# EAGLE design MotorBoard (EAGLE 7.4.0)
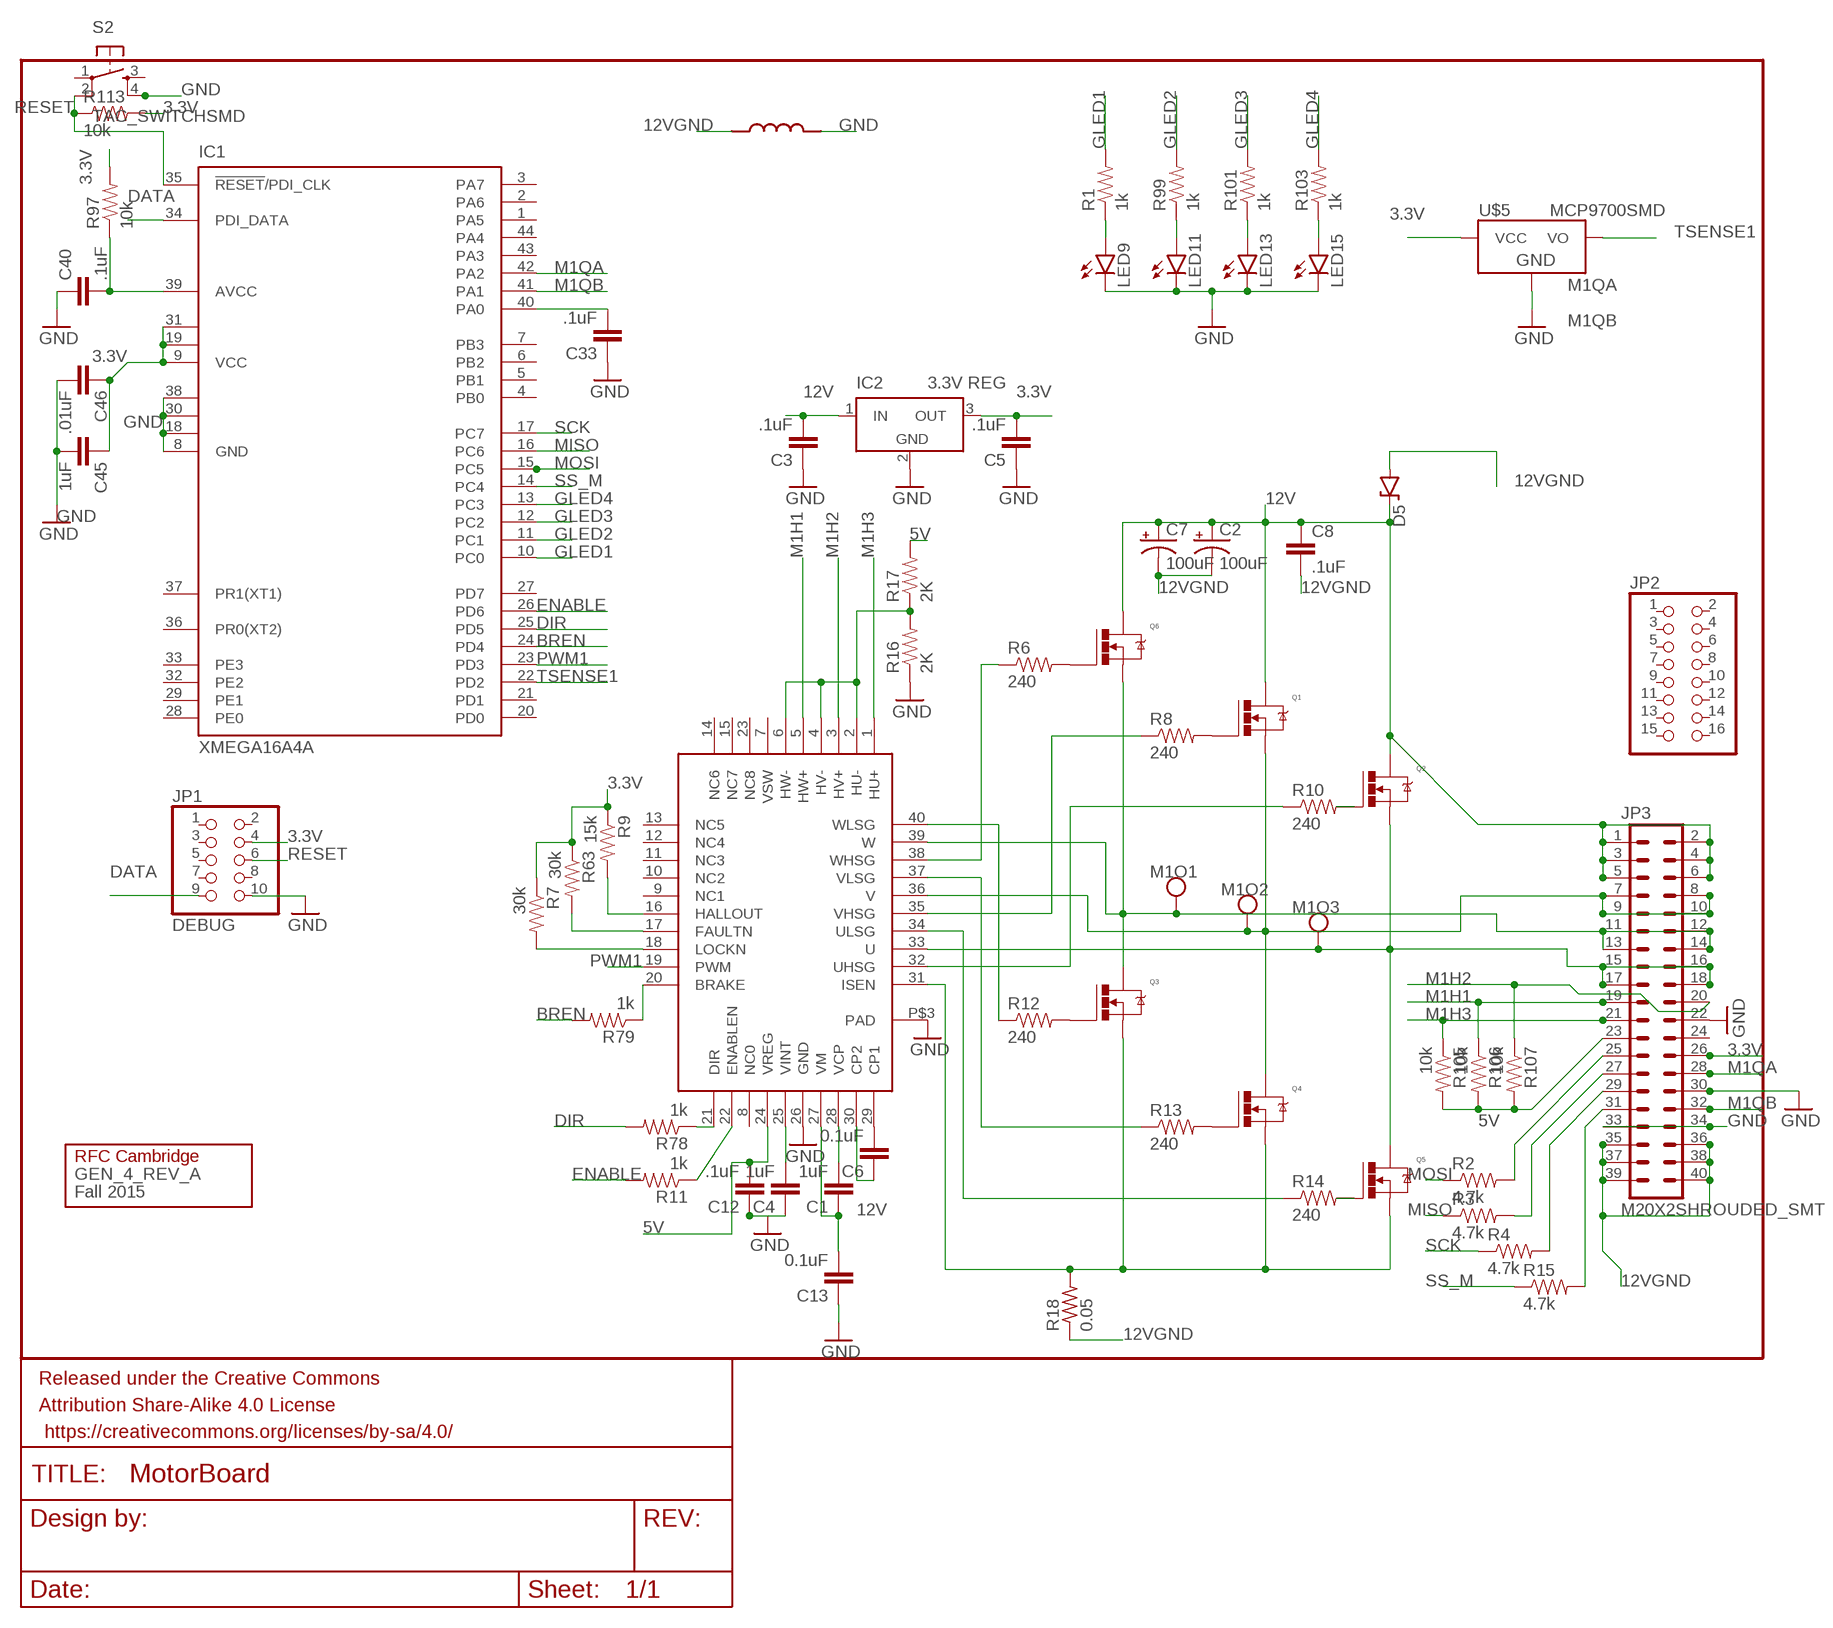
[diagram p0: schematic, sheet 1]

## Parts
C1  1uF  CAP0805  [0805]
C2  100uF  CAP-POLAR  [PANASONIC_D]
C3  .1uF  CAP0805  [0805]
C4  1uF  CAP0805  [0805]
C5  .1uF  CAP0805  [0805]
C6  0.1uF  CAP0805  [0805]
C7  100uF  CAP-POLAR  [PANASONIC_D]
C8  .1uF  CAP0805  [0805]
C12  .1uF  CAP0805  [0805]
C13  0.1uF  CAP0805  [0805]
C33  .1uF  CAP0805  [0805]
C40  .1uF  CAP0805  [0805]
C45  1uF  CAP0805  [0805]
C46  .01uF  CAP0805  [0805]
D5  DIODE-ZENERDO214AC  [DO214AC]
FRAME7  FRAME-LETTER  [CREATIVE_COMMONS]
GEN_4_REV_A  Fall 2015  LOGO  [LOGO]
IC1  XMEGA16A4A  [TQFP44]
IC2  3.3V REG  LT1129CST5  [SOT223]
JP1  DEBUG  PINHD-2X5  [2X05]
JP2  PINHD-2X8  [2X08]
JP3  M20X2SHROUDED_SMT  [2X20_SHROUDED_SMT]
LED9  LED1206  [LED-1206]
LED11  LED1206  [LED-1206]
LED13  LED1206  [LED-1206]
LED15  LED1206  [LED-1206]
M1O1  TEST_PT  [TESTING_PT]
M1O2  TEST_PT  [TESTING_PT]
M1O3  TEST_PT  [TESTING_PT]
Q1  N-MOSFET  [DPAK]
Q2  N-MOSFET  [DPAK]
Q3  N-MOSFET  [DPAK]
Q4  N-MOSFET  [DPAK]
Q5  N-MOSFET  [DPAK]
Q6  N-MOSFET  [DPAK]
R1  1k  RESISTOR0805-RES  [0805]
R2  4.7k  RESISTOR0805-RES  [0805]
R3  4.7k  RESISTOR0805-RES  [0805]
R4  4.7k  RESISTOR0805-RES  [0805]
R6  240  RESISTOR0805-RES  [0805]
R7  30k  RESISTOR0805-RES  [0805]
R8  240  RESISTOR0805-RES  [0805]
R9  15k  RESISTOR0805-RES  [0805]
R10  240  RESISTOR0805-RES  [0805]
R11  1k  RESISTOR0805-RES  [0805]
R12  240  RESISTOR0805-RES  [0805]
R13  240  RESISTOR0805-RES  [0805]
R14  240  RESISTOR0805-RES  [0805]
R15  4.7k  RESISTOR0805-RES  [0805]
R16  2K  RESISTOR0805-RES  [0805]
R17  2K  RESISTOR0805-RES  [0805]
R18  0.05  R-US_R2512  [R2512]
R63  30k  RESISTOR0805-RES  [0805]
R78  1k  RESISTOR0805-RES  [0805]
R79  1k  RESISTOR0805-RES  [0805]
R97  10k  RESISTOR0805-RES  [0805]
R99  1k  RESISTOR0805-RES  [0805]
R101  1k  RESISTOR0805-RES  [0805]
R103  1k  RESISTOR0805-RES  [0805]
R105  10k  RESISTOR0805-RES  [0805]
R106  10k  RESISTOR0805-RES  [0805]
R107  10k  RESISTOR0805-RES  [0805]
R113  10k  RESISTOR0805-RES  [0805]
S2  TAC_SWITCHSMD  [TACTILE-SWITCH-SMD]
U$1  DRV8307  [QFN40-6X6]
U$2  INDUCTOR  [0805]
U$5  MCP9700SMD  [SOT23-3]

## Nets
3.3V: C5.2 C45.1 C46.1 IC1.9(VCC) IC1.19(VCC1) IC1.31(VCC2) IC2.3(OUT) JP1.4 JP3.26 R7.1 R9.1 R63.1 R97.2 R113.2 U$5.1(VCC)
5V: C12.2 JP3.23 R17.2 R105.2 R106.2 R107.2 U$1.24(VREG)
12V: C1.1 C2.+ C3.2 C7.+ C8.1 C13.2 D5.C IC2.1(IN) JP3.1 JP3.2 JP3.3 JP3.4 JP3.5 JP3.6 Q1.DRAIN Q2.DRAIN Q6.DRAIN U$1.27(VM)
12VGND: C2.- C7.- C8.2 D5.A JP3.35 JP3.36 JP3.37 JP3.38 JP3.39 JP3.40 R18.1 U$2.1
AVCC: C40.2 IC1.39(AVCC) R97.1
BREN: IC1.24(PD4) R79.2
DATA: IC1.34(PDI_DATA) JP1.9
DIR: IC1.25(PD5) R78.2
ENABLE: IC1.26(PD6) R11.2
GLED1: IC1.10(PC0) R1.2
GLED2: IC1.11(PC1) R99.2
GLED3: IC1.12(PC2) R101.2
GLED4: IC1.13(PC3) R103.2
GND: C3.1 C4.1 C5.1 C12.1 C13.1 C33.1 C40.1 C45.2 C46.2 IC1.8(GND) IC1.18(GND1) IC1.30(GND2) IC1.38(GND3) IC2.2(GND) JP1.10 JP3.22 JP3.30 JP3.33 JP3.34 LED9.C LED11.C LED13.C LED15.C R16.1 S2.4 U$1.26(GND) U$1.P$3(PAD) U$2.2 U$5.3(GND)
M1H1: JP3.19 R106.1 U$1.5(HW+)
M1H2: JP3.20 R107.1 U$1.3(HV+)
M1H3: JP3.21 R105.1 U$1.1(HU+)
M1O1: JP3.11 JP3.12 JP3.13 JP3.14 M1O1.P$1 Q3.DRAIN Q6.SOURCE U$1.39(W)
M1O2: JP3.7 JP3.8 JP3.9 JP3.10 M1O2.P$1 Q1.SOURCE Q4.DRAIN U$1.36(V)
M1O3: JP3.15 JP3.16 JP3.17 JP3.18 M1O3.P$1 Q2.SOURCE Q5.DRAIN U$1.33(U)
M1QA: IC1.42(PA2) JP3.28
M1QB: IC1.41(PA1) JP3.32
MISO: IC1.16(PC6) R3.1
MOSI: IC1.15(PC5) R2.1
N$1: LED9.A R1.1
N$2: C6.2 U$1.29(CP1)
N$3: JP3.27 R3.2
N$4: JP3.29 R4.2
N$6: Q6.GATE R6.2
N$7: Q1.GATE R8.2
N$8: C33.2 IC1.40(PA0)
N$9: C6.1 U$1.30(CP2)
N$10: Q2.GATE R10.2
N$11: Q3.GATE R12.2
N$12: C1.2 U$1.28(VCP)
N$13: Q4.GATE R13.2
N$14: Q5.GATE R14.2
N$15: C4.2 U$1.25(VINT)
N$16: R6.1 U$1.38(WHSG)
N$17: R14.1 U$1.34(ULSG)
N$18: R13.1 U$1.37(VLSG)
N$19: R12.1 U$1.40(WLSG)
N$20: R8.1 U$1.35(VHSG)
N$21: R10.1 U$1.32(UHSG)
N$22: R16.2 R17.1 U$1.2(HU-) U$1.4(HV-) U$1.6(HW-)
N$23: R79.1 U$1.20(BRAKE)
N$24: R7.2 U$1.18(LOCKN)
N$28: R63.2 U$1.17(FAULTN)
N$31: R9.2 U$1.16(HALLOUT)
N$32: R11.1 U$1.22(ENABLEN)
N$34: JP3.31 R15.2
N$45: JP3.25 R2.2
N$98: R78.1 U$1.21(DIR)
N$114: LED11.A R99.1
N$117: LED13.A R101.1
N$119: LED15.A R103.1
O1: Q3.SOURCE Q4.SOURCE Q5.SOURCE R18.2 U$1.31(ISEN)
PWM1: IC1.23(PD3) U$1.19(PWM)
RESET: IC1.35(!RESET!/PDI_CLK) JP1.6 R113.1 S2.2
SCK: IC1.17(PC7) R4.1
SS_M: IC1.14(PC4) R15.1
TSENSE1: IC1.22(PD2) U$5.2(VO)
Unconnected: IC1.1(PA5) IC1.2(PA6) IC1.3(PA7) IC1.4(PB0) IC1.5(PB1) IC1.6(PB2) IC1.7(PB3) IC1.20(PD0) IC1.21(PD1) IC1.27(PD7) IC1.28(PE0) IC1.29(PE1) IC1.32(PE2) IC1.33(PE3) IC1.36(PR0(XT2)) IC1.37(PR1(XT1)) IC1.43(PA3) IC1.44(PA4) JP1.1 JP1.2 JP1.3 JP1.5 JP1.7 JP1.8 JP2.1 JP2.2 JP2.3 JP2.4 JP2.5 JP2.6 JP2.7 JP2.8 JP2.9 JP2.10 JP2.11 JP2.12 JP2.13 JP2.14 JP2.15 JP2.16 JP3.24 S2.1 S2.3 U$1.7(VSW) U$1.8(NC0) U$1.9(NC1) U$1.10(NC2) U$1.11(NC3) U$1.12(NC4) U$1.13(NC5) U$1.14(NC6) U$1.15(NC7) U$1.23(NC8)

## Power pins joined to a net without a drawn wire
GND: IC2.4(GND)

## Library data of the parts
C1 C4 C6 C8 C12 C13 = SparkFun-Passives:CAP: Capacitor Standard 0603 ceramic capacitor, and 0.1" leaded capacitor.
C2 C7 = gen3:CAP-POLAR: Cap Alum Polarized Digikey: 493-3953-1-ND low impedence, low ceiling cap; PROD_ID: CAP-10547
C3 C5 C33 C40 C45 C46 = SparkFun-Capacitors:CAP: Capacitor Standard 0603 ceramic capacitor, and 0.1" leaded capacitor.
D5 = gen3:DIODE-ZENER: Zener Diode Production Part - 8199 3.4V Zener Voltage
FRAME7 = SparkFun-Aesthetics:FRAME-LETTER: Schematic Frame Standard 8.5x11 US Letter frame
GEN_4_REV_A = gen3:LOGO
IC1 = atmel:XMEGA16A4: MICROCONTROLLER Features High-performance, Low-power 8/16-bit AVR XMEGA Microcontroller Non-Volatile Program and Data Memories - 16 KB - 128 KB of In-System Self-Programmable Flash - 4 KB - 8 KB Boot Code Section with Independent Lock Bits - 1 KB - 2 KB EEPROM - 2 KB - 8 KB Internal SRAM Peripheral Features - Four-channel DMA Controller with support for external requests - Eight-channel Event System - Five 16-bit Timer/Counters Three Timer/Counters with 4 Output Compare or Input Capture channels Two Timer/Counters with 2 Output Compare or Input Capture channels High-Resolution Extensions on all Timer/Counters Advanced Waveform Extension on one Timer/Counter - Five USARTs IrDA Extension on one USART - Two Two-Wire Interfaces with dual address match (I2C and SMBus compatible) - Two SPIs (Serial Peripheral Interfaces) peripherals - AES and DES Crypto Engine - 16-bit Real Time Counter with Separate Oscillator - One Twelve-channel, 12-bit, 2 Msps Analog to Digital Converter - One Two-channel, 12-bit, 1 Msps Digital to Analog Converter - Two Analog Comparators with Window compare function - External Interrupts on all General Purpose I/O pins - Programmable Watchdog Timer with Separate On-chip Ultra Low Power Oscillator Special Microcontroller Features - Power-on Reset and Programmable Brown-out Detection - Internal and External Clock Options with PLL - Programmable Multi-level Interrupt Controller - Sleep Modes: Idle, Power-down, Standby, Power-save, Extended Standby - Advanced Programming, Test and Debugging Interfaces PDI (Program and Debug Interface) for programming, test and debugging I/O and Packages - 34 Programmable I/O Lines - 44 - lead TQFP - 44 - pad VQFN/QFN - 49 - ball VFBGA Operating Voltage - 1.6 - 3.6V Speed performance - 0 - 12 MHz @ 1.6 - 3.6V - 0 - 32 MHz @ 2.7 - 3.6V Drawn by Dipl.-Ing. (FH) Robert Siegler Created: 27.05.09; OC_FARNELL: unknown; OC_NEWARK: unknown
IC2 = linear-technology:LT1129CST5: VOLTAGE REGULATOR with shutdown; MPN: LT1129CST-5#PBF; OC_FARNELL: 1663375; OC_NEWARK: 57M2069
JP1 = pinhead:PINHD-2X5: PIN HEADER
JP2 = pinhead:PINHD-2X8: PIN HEADER
JP3 = SparkFun-Connectors:M20X2: 0.1" spaced headers
LED9 LED11 LED13 LED15 = SparkFun-LED:LED: LEDs Standard schematic elements and footprints for 5mm, 3mm, 1206, and 0603 sized LEDs. 5mm - Spark Fun Electronics SKU : COM-00529 (and others)
M1O1-M1O3 = gen3:TEST_PT: Testing Point Use to probe a signal
Q1-Q6 = rfc:N-MOSFET: N-Channel Power Mosfet
R1-R4 R15 R97 R99 R101 R103 R113 = SparkFun-Passives:RESISTOR: Resistor Basic schematic elements and footprints for 0603, 1206, and PTH resistors.
R6-R14 R16 R17 R63 R78 R79 R105-R107 = SparkFun-Resistors:RESISTOR: Resistor Basic schematic elements and footprints for 0603, 1206, and PTH resistors.
R18 = resistor:R-US_: RESISTOR, American symbol
S2 = SparkFun-Retired:TAC_SWITCH: Momentary Switch Button commonly used for reset or general input. Spark Fun Electronics SKU : COM-00097 SMT- SWCH-08247; PROD_ID: SWCH-08247
U$1 = texas2:DRV8307
U$2 = gen3:INDUCTOR
U$5 = SparkFun-Sensors:MCP9700: Analog-output temperature sensor; PROD_ID: IC-08917

## Board
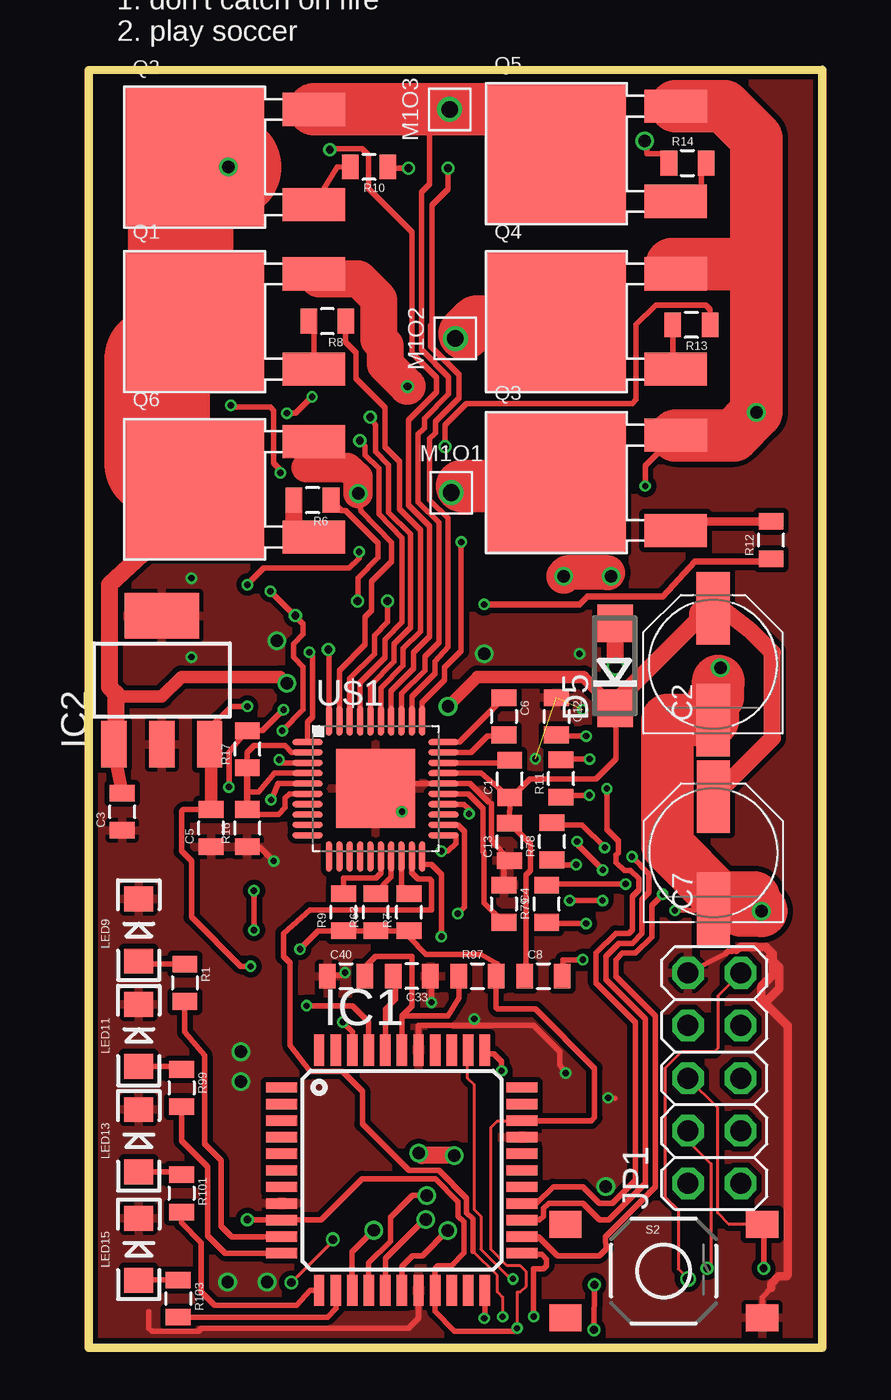
[diagram p1: board, top side]
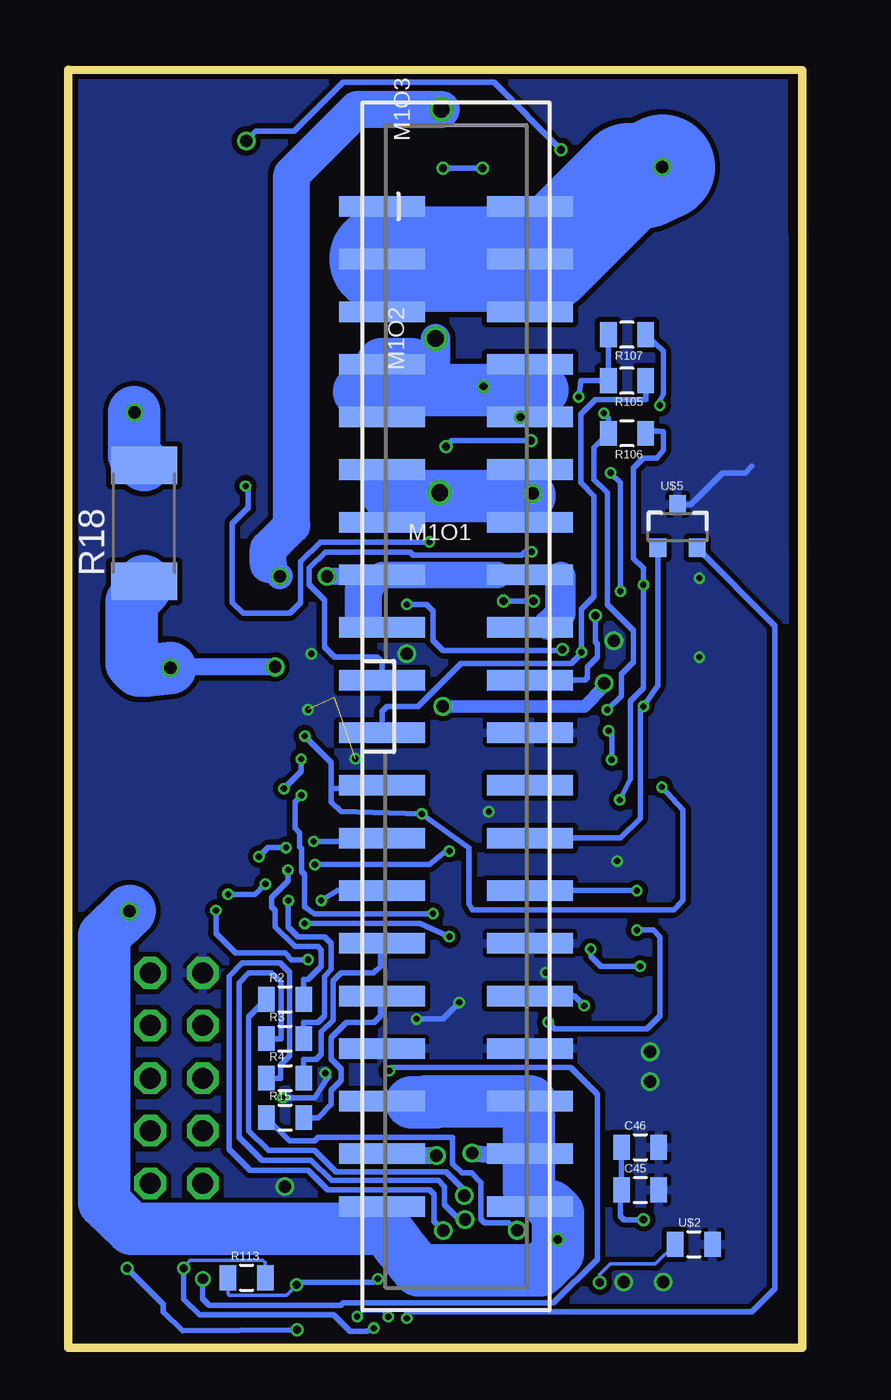
[diagram p2: board, bottom side, seen from below]

Size 35.42 x 61.68 mm. Coordinates in mm from the lower left corner, seen from the top.
Outline: 0,0 0,61.66 35.42,61.68 35.42,0 0,0
Copper layers (1*16): Top 0.018mm / dielectric 1.55mm / Bottom 0.018mm
Design rules "eC_2Layer_PClass6_BaseCopperO18_eCDefault": minimum track width 0.15mm, minimum drill 0.35mm, track to track 0.15mm, track to pad 0.15mm, pad to pad 0.15mm, via to via 0.15mm, smd to smd 0mil, copper to edge 0.25mm, drill to drill 0.35mm, minimum pad ring 0.175mm, minimum via ring 0.125mm, stop-mask expansion 0mil, vias tented up to drill 0.45mm, thermal gap 0.2mm

### Footprints (pad centres in the part's own frame; a part is rotated, then mirrored left to right if it is on the bottom)
0805 = smd 0.8 x 1.2: 1 -0.9,0; 2 0.9,0
PANASONIC_D = smd 3.5 x 1.6: + 2.7,0; - -2.7,0
DO214AC = smd 1.8 x 1.7: A 2.05,0; C -2.05,0
TQFP44 = smd 1.5 x 0.5: 1 -5.8,4; 2 -5.8,3.2; 3 -5.8,2.4; 4 -5.8,1.6; 5 -5.8,0.8; 6 -5.8,0; 7 -5.8,-0.8; 8 -5.8,-1.6; 9 -5.8,-2.4; 10 -5.8,-3.2; 11 -5.8,-4; 23 5.8,-4; 24 5.8,-3.2; 25 5.8,-2.4; 26 5.8,-1.6; 27 5.8,-0.8; 28 5.8,0; 29 5.8,0.8; 30 5.8,1.6; 31 5.8,2.4; 32 5.8,3.2; 33 5.8,4 | smd 0.5 x 1.5: 12 -4,-5.8; 13 -3.2,-5.8; 14 -2.4,-5.8; 15 -1.6,-5.8; 16 -0.8,-5.8; 17 0,-5.8; 18 0.8,-5.8; 19 1.6,-5.8; 20 2.4,-5.8; 21 3.2,-5.8; 22 4,-5.8; 34 4,5.8; 35 3.2,5.8; 36 2.4,5.8; 37 1.6,5.8; 38 0.8,5.8; 39 0,5.8; 40 -0.8,5.8; 41 -1.6,5.8; 42 -2.4,5.8; 43 -3.2,5.8; 44 -4,5.8
SOT223 = smd 1.219 x 2.235: 1 -2.311,-3.099; 2 0,-3.099; 3 2.311,-3.099 | smd 3.6 x 2.2: 4 0,3.099
2X05 = drill 1.016 octagon: 1 -5.08,-1.27; 2 -5.08,1.27; 3 -2.54,-1.27; 4 -2.54,1.27; 5 0,-1.27; 6 0,1.27; 7 2.54,-1.27; 8 2.54,1.27; 9 5.08,-1.27; 10 5.08,1.27
2X08 = drill 1.016 octagon: 1 -8.89,-1.27; 2 -8.89,1.27; 3 -6.35,-1.27; 4 -6.35,1.27; 5 -3.81,-1.27; 6 -3.81,1.27; 7 -1.27,-1.27; 8 -1.27,1.27; 9 1.27,-1.27; 10 1.27,1.27; 11 3.81,-1.27; 12 3.81,1.27; 13 6.35,-1.27; 14 6.35,1.27; 15 8.89,-1.27; 16 8.89,1.27
2X20_SHROUDED_SMT = smd 4.14 x 0.991: 1 -3.569,24.13; 2 3.569,24.13; 3 -3.569,21.59; 4 3.569,21.59; 5 -3.569,19.05; 6 3.569,19.05; 7 -3.569,16.51; 8 3.569,16.51; 9 -3.569,13.97; 10 3.569,13.97; 11 -3.569,11.43; 12 3.569,11.43; 13 -3.569,8.89; 14 3.569,8.89; 15 -3.569,6.35; 16 3.569,6.35; 17 -3.569,3.81; 18 3.569,3.81; 19 -3.569,1.27; 20 3.569,1.27; 21 -3.569,-1.27; 22 3.569,-1.27; 23 -3.569,-3.81; 24 3.569,-3.81; 25 -3.569,-6.35; 26 3.569,-6.35; 27 -3.569,-8.89; 28 3.569,-8.89; 29 -3.569,-11.43; 30 3.569,-11.43; 31 -3.569,-13.97; 32 3.569,-13.97; 33 -3.569,-16.51; 34 3.569,-16.51; 35 -3.569,-19.05; 36 3.569,-19.05; 37 -3.569,-21.59; 38 3.569,-21.59; 39 -3.569,-24.13; 40 3.569,-24.13
LED-1206 = smd 1.2 x 1.4: A -1.5,0; C 1.5,0
TESTING_PT = drill 0.8: P$1 0,0
DPAK = smd 6.7 x 6.7: DRAIN 0,0 | smd 3 x 1.6: GATE 5.75,-2.3; SOURCE 5.75,2.3
R2512 = smd 1.8 x 3.2: 1 -2.8,0; 2 2.8,0
TACTILE-SWITCH-SMD = smd 1.55 x 1.3: 1 -4.75,2.25; 2 4.75,2.25; 3 -4.75,-2.25; 4 4.75,-2.25
QFN40-6X6 = smd 1.458 x 0.28: 1 -3.279,2.25; 2 -3.279,1.75; 3 -3.279,1.25; 4 -3.279,0.75; 5 -3.279,0.25; 6 -3.279,-0.25; 7 -3.279,-0.75; 8 -3.279,-1.25; 9 -3.279,-1.75; 10 -3.279,-2.25; 21 3.279,-2.25; 22 3.279,-1.75; 23 3.279,-1.25; 24 3.279,-0.75; 25 3.279,-0.25; 26 3.279,0.25; 27 3.279,0.75; 28 3.279,1.25; 29 3.279,1.75; 30 3.279,2.25 | smd 0.28 x 1.458: 11 -2.25,-3.279; 12 -1.75,-3.279; 13 -1.25,-3.279; 14 -0.75,-3.279; 15 -0.25,-3.279; 16 0.25,-3.279; 17 0.75,-3.279; 18 1.25,-3.279; 19 1.75,-3.279; 20 2.25,-3.279; 31 2.25,3.279; 32 1.75,3.279; 33 1.25,3.279; 34 0.75,3.279; 35 0.25,3.279; 36 -0.25,3.279; 37 -0.75,3.279; 38 -1.25,3.279; 39 -1.75,3.279; 40 -2.25,3.279 | smd 3.81 x 3.81: P$3 0,0
SOT23-3 = smd 0.8 x 0.9: 1 -0.95,-1; 2 0.95,-1; 3 0,1.1

### Placement (x,y rotation side)
C1  20.33,27.45 90 top
C2  30.14,32.98 90 top
C3  1.64,25.87 90 top
C4  20.05,21.42 270 top
C5  5.92,25.07 90 top
C6  20.05,30.47 270 top
C7  30.16,23.88 90 top
C8  21.95,17.93 0 top
C12  22.59,30.47 270 top
C13  20.32,24.41 90 top
C33  15.61,17.93 180 top
C40  12.43,17.93 0 top
C45  7.83,7.61 0 bottom
C46  7.83,9.67 0 bottom
D5  25.42,32.91 90 top
FRAME7  -68.08,70.17 0 top  (outside the outline)
GEN_4_REV_A  3.38,69.4 0 top  (outside the outline)
IC1  15.13,8.56 0 top
IC2  3.54,32.22 0 top
JP1  30.21,13.01 90 top
JP2  -78.32,-5.65 0 top  (outside the outline)
JP3  16.72,30.95 0 bottom
LED9  2.43,20.15 90 top
LED11  2.43,15.07 90 top
LED13  2.43,9.99 90 top
LED15  2.43,4.75 90 top
M1O1  17.51,41.27 0 top
M1O2  17.71,48.7 90 top
M1O3  17.43,59.76 90 top
Q1  5.13,49.52 0 top
Q2  5.13,57.46 0 top
Q3  22.59,41.74 0 top
Q4  22.59,49.52 0 top
Q5  22.59,57.62 0 top
Q6  5.13,41.42 0 top
R1  4.65,17.61 270 top
R2  24.97,16.82 0 bottom
R3  24.97,14.91 0 bottom
R4  24.97,13.01 0 bottom
R6  10.81,40.9 180 top
R7  15.47,21.02 90 top
R8  11.53,49.53 180 top
R9  12.3,21.02 90 top
R10  13.54,56.98 180 top
R11  22.81,27.46 90 top
R12  32.94,38.97 90 top
R13  29.1,49.36 180 top
R14  28.91,57.17 0 top
R15  24.97,11.1 0 bottom
R16  7.67,25.07 90 top
R17  7.67,28.88 90 top
R18  31.77,39.79 90 bottom
R63  13.87,21.02 90 top
R78  22.38,24.44 90 top
R79  22.11,21.42 90 top
R97  18.78,17.93 0 top
R99  4.49,12.53 270 top
R101  4.49,7.45 270 top
R103  4.33,2.37 270 top
R105  8.46,46.66 180 bottom
R106  8.46,44.12 180 bottom
R107  8.46,48.89 180 bottom
R113  26.82,3.38 0 bottom
S2  27.76,3.7 0 top
U$1  13.86,26.98 0 top
U$2  5.23,4.99 0 bottom
U$5  6.02,39.59 0 bottom

### Tracks (layer width: path | path; a pad name or v marks a point on that pad's centre or on a via)
3.3V  (via drill 0.3, 0.38)
  Top 0.152: v20.69,0.94 20.69,2.69 20.84,2.69 21.1,2.95 21.1,3.7 20.84,3.96 20.21,3.96 19.42,4.75 19.42,10.63 19.73,10.94 20.91,10.94 IC1.31 | JP1.4 28.94,9.99 30.05,8.88 30.05,4.03 v29.86,3.84
  Top 0.254: C5.2 4.6,25.97 4.49,25.87 4.49,23.96 4.97,23.48 4.97,20.79 7.35,18.4 v7.83,18.4 | v20.69,0.94 20.53,0.78 17.67,0.78 16.73,1.75 IC1.19 16.72,3.73 16.72,3.8 16.88,3.96 17.51,3.96 18.12,4.57 18.12,6.07 17.85,6.34 17.85,7.04 16.74,8.15 13.21,8.15 11.23,6.16 IC1.9 7.85,6.16 v7.67,6.18 | IC2.3 5.85,29.92 6.87,30.95 v7.67,30.95 | IC1.31 20.95,10.94 24.26,10.94 24.43,11.11 24.43,13.49 21.58,16.34 19.73,16.34 19.68,16.39 R97.2 19.73,18.09 19.73,18.51 18.94,18.99 16.29,18.99 15.47,19.81 R7.1 R63.1 R9.1 11.09,20.12 v10.21,19.23
  Top 0.61: C5.2 5.92,29.05 IC2.3
  Bottom 0.178: R113.2 25.92,4.11 26.06,4.22 29.56,4.22 29.86,3.91 v29.86,3.84
  Bottom 0.254: v10.21,19.23 10.21,18.88 9.73,18.4 8.86,18.4 v7.83,18.4 | U$5.1 6.97,31.96 v7.67,30.95 7.83,30.79 7.83,25.55 8.78,24.59 JP3.26 | v20.69,0.94 21,0.78 21.83,0.78 22.62,1.58 29.1,1.58 29.86,2.34 v29.86,3.84 | v7.67,6.18 8.62,6.18 8.78,6.34 8.78,7.56 C45.1 C46.1
5V  (via drill 0.3)
  Top 0.254: U$1.24 18.13,26.23 18.37,26 v18.37,25.76 | C12.2 22.64,29.52 v24.02,29.52 | v6.78,27.05 6.78,28.75 R17.2 8.41,29.78 v9.41,30.79 | v9.58,45.1 10,45.1 v10.79,45.89
  Bottom 0.254: v24.02,29.52 22.75,28.25 22.75,26.98 | v6.78,27.05 5.76,25.95 5.76,21.58 6.21,21.14 15.92,21.14 16.08,21.42 16.08,24.12 v18.37,25.76 22.27,25.87 22.75,26.34 22.75,26.98 | 22.75,26.98 20.44,26.98 JP3.23 | R107.2 R105.2 10.68,46.66 v10.79,45.89 | v9.58,45.1 9.36,44.86 R106.2 10.05,43.43 10.05,41.9 9.41,41.26 9.41,35.87 8.14,34.6 8.14,33.1 8.74,32.5 8.74,31.46 v9.41,30.79
12V  (via drill 0.6)
  Top 0.254: C1.1 C13.2 21.33,24.31 21.33,23.03 21.12,22.82 21.12,18 C8.1 21.06,18.03 21,18.09 | U$1.27 18.94,27.73 C1.1 | C1.1 20.42,26.55 21.32,27.45 24.5,27.45 25.45,28.41 25.45,30.83 D5.C
  Top 0.61: IC2.1 1.16,29.05 C3.2 1.32,28.41 1.32,31.42 3.54,31.42 4.49,32.37 9.26,32.37 v9.57,32.06 | v17.35,30.95 18.78,32.37 23.9,32.37 D5.C
  Top 0.813: 30.21,26.5 C7.+ 33.01,29.43 33.01,33.54 31.96,34.6 30.55,35.68 C2.+ 29.42,35.55 29.42,35.14 25.42,31.14 D5.C | Q6.DRAIN 5.13,40.63 1,36.82 1,31.9 1.32,31.58 1.32,31.42 1.32,29.5 IC2.1
  Top 5.08: Q6.DRAIN 4.54,41.42 3.31,42.66 3.31,47.7 Q1.DRAIN 5.13,50.5 4.45,51.18 4.45,56.78 Q2.DRAIN 5.66,56.92 v6.76,56.98
  Bottom 0.61: v9.57,32.06 9.57,31.9 10.53,30.95 v17.35,30.95
  Bottom 0.813: JP3.5 JP3.3 JP3.1 | JP3.6 JP3.4 | JP3.2 13.65,54.58 13.65,52.54
  Bottom 5.08: v6.76,56.98 7.62,56.56 8.37,56.56 12.4,52.54 JP3.4 13.65,52.54 JP3.3
12VGND  (via drill 0.3, 0.41, 0.6)
  Top 0.178: v9.78,3.14 11.8,5.16 v11.8,5.23
  Top 0.254: C7.- 30.18,21.13 v28.31,21.1 | v23.86,18.72 22.91,18.72 22.91,17.98 C8.2
  Top 0.813: C7.- 31.29,21.08 31.48,21.1 32.12,21.74 | 29.89,30.15 C2.- | D5.A 25.42,32.88 v25.45,32.85 | v17.66,9.27 16.08,9.27 v15.94,9.39 | 30.4,32.17 30.5,32.27 v30.5,32.81 30.46,32.85 30.05,32.85
  Top 2.54: 31.48,21.1 31.59,21.1 v32.48,21.07 | 32.12,21.74 30.42,21.74 27.94,24.23 27.94,30.28 C2.- 30.14,31.18 30.37,31.4 30.37,32.05 30.4,32.08 30.4,32.11 30.4,32.17
  Bottom 0.152: 18.15,11.9 18.15,11.84 18.15,11.83
  Bottom 0.178: U$2.1 7.08,4.04 9.26,4.04 9.78,3.52 v9.78,3.14
  Bottom 0.254: v28.31,21.1 28.31,19.99 27.35,19.04 24.97,19.04 24.65,18.72 v23.86,18.72 | JP3.37 20.21,9.28 | JP3.39 20.29,6.06 20.32,6.03 | JP3.35 18.94,11.9 18.87,11.83
  Bottom 0.406: JP3.36 13.19,11.9 13.19,11.08
  Bottom 0.813: JP3.38 JP3.40 11.64,6.9 11.64,6.82 12.13,6.82 13.07,6.82 | v25.45,32.85 30.05,32.85 30.1,32.81 v30.5,32.81 | 20.21,6.66 20.37,6.82 JP3.39 20.89,6.21 20.89,5.74 | 13.2,10.1 13.15,10.1 JP3.38 | 13.2,7.64 13.29,7.64 13.29,6.89 | 20.21,9.28 17.67,9.28 v17.66,9.27 | v15.94,9.39 13.26,9.25 JP3.38
  Bottom 2.54: 13.19,11.08 13.2,11.08 13.2,10.1 | 13.07,9.36 JP3.38 13.2,9.36 13.2,7.64 | 20.32,6.03 19.45,4.87 18.52,3.73 12.65,3.73 11.8,4.58 11.8,5.15 v11.8,5.23 11.8,6.48 12.13,6.82 | 18.87,11.83 18.15,11.83 17.7,11.83 | 18.15,11.9 JP3.36 | 20.89,5.74 20.91,5.73 32.38,5.73 33.69,7.02 33.69,19.86 v32.48,21.07 | v30.5,32.81 31.64,32.68 32.03,32.68 32.36,33.01 32.36,36 31.77,36.59 R18.1
AVCC
  Top 0.254: R97.1 17.88,16.87 17.35,16.02 15.13,16.02 | 15.13,16.02 IC1.39 | C40.2 13.33,18.35 13.86,18.88 15.61,18.88 15.61,16.5 15.13,16.02
BREN  (via drill 0.3)
  Top 0.254: v25.92,22.37 22.64,22.37 R79.2 | IC1.24 21.72,5.36 22.64,4.43 24.65,4.43 24.97,4.75 24.95,5.36 27.35,7.77 27.35,16.02 25.45,17.93 25.45,18.72 25.77,19.04 26.4,19.04 27.19,19.83 27.19,21.35 v27.72,21.88
  Bottom 0.254: v27.72,21.88 26.42,21.88 v25.92,22.37
DATA  (via drill 0.3, 0.5)
  Top 0.152: JP1.9 30.37,16.98 30.37,14.44 30.21,14.28 28.62,14.28 27.83,13.48 27.83,7.29 28.46,6.66 28.46,3.8 v28.94,3.32
  Top 0.254: IC1.34 19.31,14.18 19.56,14.18 19.94,13.81 v19.94,13.36
  Bottom 0.254: v28.94,3.32 28.94,2.37 28.62,2.05 22.27,2.05 22.17,2.16 12.01,2.16 9.89,4.28 9.89,12.21 11.19,13.52 19.78,13.52 v19.94,13.36
DIR  (via drill 0.3)
  Top 0.254: IC1.25 21.78,6.16 21.96,6.34 21.96,6.72 22.23,6.97 22.24,6.98 23.86,6.98 24.65,6.18 25.11,6.16 26.88,7.93 26.88,15.86 24.97,17.77 24.97,18.88 25.61,19.52 26.24,19.52 26.72,19.99 26.72,21.64 27.06,21.97 27.06,22.87 v26.23,23.7 | R78.2 22.7,25.23 23.83,25.23 v24.92,24.13
  Bottom 0.254: v24.92,24.13 25.8,24.13 v26.23,23.7
ENABLE  (via drill 0.3)
  Top 0.254: IC1.26 21.63,6.96 22.43,7.77 23.86,7.77 24.65,6.97 25.28,6.96 26.4,8.09 26.4,15.71 24.5,17.61 24.5,19.04 25.45,19.99 26.08,19.99 26.24,20.15 26.24,21.77 26.57,22.1 26.57,22.63 26.17,23.03 25.86,23.03 25.47,23.43 25.47,23.77 25.58,23.88 25.58,24.47 25.56,24.47 25.03,25 v25.02,26.98 | v24.19,28.41 22.64,28.41 R11.2
  Bottom 0.254: v25.02,26.98 24.19,27.81 v24.19,28.41
GLED1
  Top 0.254: R1.2 4.65,15.23 5.6,14.12 5.6,9.83 6.4,9.04 6.4,5.86 6.9,5.36 IC1.10
GLED2
  Top 0.254: R99.2 4.49,9.99 5.76,8.72 5.76,5.39 6.59,4.56 IC1.11
  Top 0.406: R99.2 4.49,11.74
GLED3
  Top 0.254: IC1.12 10.69,2.76 10.05,2.05 6.08,2.05 5.45,2.69 5.45,5.07 4.49,6.02 R101.2
GLED4
  Top 0.254: R103.2 11.53,1.47 11.95,1.89 11.95,1.94 IC1.13
GND  (via drill 0.3, 0.6)  (2 unrouted)
  Top 0.254: v18.62,15.86 18.62,15.71 18.46,15.55 15.93,15.55 IC1.38 15.92,15.55 21.48,15.55 22.75,14.28 22.75,13.64 v23.03,13.25 | v16.56,16.66 16.56,17.88 C33.1 | IC1.18 15.93,1.42 15.45,0.94 5.45,0.94 5.29,0.78 3.06,0.78 2.91,0.94 2.91,1.74 | v25.08,12.05 25.42,12.04 | v15.13,25.87 14.97,25.87 U$1.P$3 14.11,27.23 U$1.26 18.4,27.23 19.3,26.33 19.44,26.26 19.44,24.49 20.32,23.54 C13.1 20.05,23.24 C4.1 | v8.94,23.48 8.25,24.17 R16.1 | v12.38,18.1 12.38,17.98 12.4,17.96 11.56,17.96 C40.1 | S2.4 32.51,2.44 32.96,2.88 | 31.25,19.21 31.17,19.21 31.11,19.16 31.07,19.16 31.04,19.13 30.87,19.13 30.74,19.01 JP1.10
  Top 0.406: 32.96,2.88 32.96,3.1 33.3,3.43 33.67,3.43 33.76,3.52 33.76,15.53 32.47,16.82 | 32.47,16.82 32.82,16.82 33.34,17.34 33.34,18.35 32.86,18.84 | 32.47,16.82 32.47,17.45 33.02,18 33.02,19.01 32.69,19.35 31.47,19.35 31.27,19.2 31.26,19.2 31.25,19.21
  Bottom 0.254: v18.62,15.86 17.35,15.86 v16.56,16.66 | U$5.3 5.38,40.69 3.86,42.22 2.75,42.22 2.43,42.53 | v23.03,13.25 22.87,13.09 23.54,12.05 v25.08,12.05 | 8.94,23.4 v8.94,23.48
  other vias: 6.71,3.17 8.62,3.17 7.35,12.85 7.35,14.28 9.1,34.12 24.97,7.77 19.1,33.49 21.57,28.42 23.86,30.79 4.97,37.14 4.97,33.33 23.7,33.49
  pour Top (isolate 0.254): 36.02,61.14 0.89,61.29 0.36,0.42 36.14,0.38
  pour Bottom (isolate 0.254): 0.89,61.29 0.79,0.74 36.14,0.38 36.14,61.14
M1H1  (via drill 0.3)
  Top 0.254: U$1.5 9.16,27.23 8.87,26.49 v8.81,26.44 | v13.07,38.41 13.07,38.09 12.59,37.61 8.46,37.61 v7.67,36.82
  Bottom 0.254: R106.1 7.56,44.23 6.93,44.23 6.72,44.2 6.72,43.33 7.03,42.93 7.67,42.93 8.14,42.46 8.14,38.09 7.67,37.61 v7.67,36.82 7.67,31.84 8.3,31.21 8.3,27.45 v8.81,26.44 | JP3.19 20.29,33.09 20.53,33.33 22.59,33.33 23.07,33.8 23.07,36.09 23.8,36.82 23.8,37.61 23,38.41 18.94,38.41 18.78,38.25 13.54,38.25 13.38,38.41 v13.07,38.41
M1H2  (via drill 0.3, 0.38)
  Top 0.254: v9.35,29.77 10.37,30.79 10.37,32.85 9.89,33.33 9.89,33.96 10.37,34.44 10.37,34.91 | 10.37,34.91 v8.78,36.5 | v9.26,42.22 9.26,42.38 8.94,42.69 8.94,45.23 8.78,45.39 7.03,45.39 v6.87,45.47 | v9.99,35.33 10.37,34.91 | U$1.3 9.34,28.23 v9.2,28.37
  Bottom 0.254: v8.78,36.5 8.78,41.74 v9.26,42.22 | v6.87,45.47 6.87,45.71 6.72,46.03 6.72,48.09 R107.1 | JP3.20 10.49,32.22 10.37,32.34 10.37,32.85 9.89,33.33 9.89,33.96 9.99,34.06 v9.99,35.33 | v9.2,28.37 9.2,29.62 v9.35,29.77
M1H3  (via drill 0.3)
  Top 0.254: U$1.1 10.58,30.21 10.81,30.44 10.81,33.36 10.64,33.56 v10.66,33.56
  Bottom 0.254: 10.68,41.74 10.05,41.11 10.05,36.25 10.66,35.64 v10.66,33.56 10.77,33.4 10.83,33.33 11.15,33.01 16.48,33.01 18.54,30.95 20.05,30.95 20.29,30.71 JP3.21 | 10.68,41.74 | R105.1 7.67,46.5 7.56,46.56 R105.1 | 10.68,41.74 10.68,45.05 9.98,45.75 7.56,45.75 R105.1
M1O1  (via drill 0.6)
  Top 0.254: U$1.39 12.11,32.69 13.35,33.93 13.35,35.26 13.67,35.58 13.67,36.98 14.62,37.93 14.62,38.85 13.16,40.38 13.11,40.63 13.15,40.63 13.15,40.71 13.15,41.09 v13.02,41.22
  Top 0.305: 11.64,43.65 10.96,43.65 Q6.SOURCE
  Top 0.813: 11.64,42.53 11.64,43.65 | Q3.DRAIN 22.27,41.42 22.27,41.26 20.73,41.26 20.65,41.35 | 20.13,41.35 20.08,41.4 20.04,41.4 | M1O1.P$1 17.79,41.69 18.02,41.59
  Top 1.422: 11.64,42.53 10.5,42.47 12.5,42.46 13.02,42.01 v13.02,41.22
  Top 2.54: 18.02,41.59 20.37,41.58 | 20.65,41.35 20.47,41.53 20.37,41.58 | 20.37,41.58 20.13,41.35
  Bottom 0.406: JP3.12 13,42.23 12.77,42.23 13.15,41.85 13.15,40.71
  Bottom 0.813: JP3.11 20.08,42.17 20.08,41.26 19.92,41.26 19.66,41.53 19.95,41.53 20.13,41.35 | v13.02,41.22 13.16,41.17 | 13.16,41.17 13.16,41.11 | JP3.14 13.15,40.71 13.16,41.17 | JP3.13 20.29,40.74 19.92,41.11 | 20.13,41.35 20.15,41.37 | 20.13,41.35 17.59,41.35 M1O1.P$1
  Bottom 2.54: 20.08,41.26 19.92,41.11 13.16,41.11
M1O2  (via drill 0.38)
  Top 0.254: U$1.36 13.61,31.97 14.75,33.11 14.75,33.96 15.54,34.76 15.54,39.26 14.49,40.31 14.49,42.6 13.86,43.23 13.86,44.53 v13.6,44.91 | 11.11,51.58 Q1.SOURCE
  Top 0.813: 22.58,48.71 22.58,49.03 Q4.DRAIN | 13.97,50.64 13.97,50.6 14,50.57 | M1O2.P$1 17.85,48.85
  Top 1.422: 17.85,48.85 17.94,48.94 18.15,48.94
  Top 1.778: 11.11,51.58 13.03,51.58 13.97,50.64 | 14,50.57 14,48.67 14.32,48.35 14.32,47.47 v15.4,46.39
  Top 2.54: 18.15,48.94 18.73,49.52 Q4.DRAIN
  Bottom 0.254: JP3.9 21.39,46.02 21.39,46.13 | v13.6,44.91 13.36,44.7 JP3.10 | JP3.8 13.15,46.83 12.55,46.22
  Bottom 0.813: 12.55,46.22 12.55,45.51 JP3.10 | JP3.7 20.29,46.81 20.88,46.21
  Bottom 1.422: M1O2.P$1 17.7,48.7 17.7,47.16 18.01,47.47 18.89,47.47
  Bottom 1.778: v15.4,46.39 15.14,46.22 | 15.14,46.22
  Bottom 2.54: 12.55,46.22 15.14,46.22 20.88,46.21 21.31,46.21 21.39,46.13 | JP3.7 18.89,47.47
M1O3  (via drill 0.6)
  Top 0.254: U$1.33 15.11,31.56 16.24,32.69 | 16.24,32.69 | 23.23,57.46 23.23,57.54 21,59.76 | 16.24,32.69 16.24,33.37 16.91,34.04 16.91,39.81 15.91,40.81 15.91,44.09 16.21,44.39 16.21,44.84 17.39,46.01 17.39,46.85 16.07,48.16 16.07,55.76 16.46,56.16 16.46,58.57 16.59,58.7 17.35,58.7 17.48,58.82 17.48,59.71 M1O3.P$1
  Top 0.813: 21,59.76 23.23,59.76 | 23.23,57.46 22.75,57.46 Q5.DRAIN | v25.23,37.23 25.06,37.4
  Top 1.676: 25.06,37.4 23.1,37.4 v22.94,37.23
  Top 2.54: Q2.SOURCE M1O3.P$1 21,59.76
  Bottom 0.254: 14.71,37.3 14.48,37.1 11.93,37.1 12.27,36.76 12.27,34.88 13.02,34.88 JP3.18
  Bottom 0.61: 17.35,59.68 M1O3.P$1
  Bottom 0.813: v22.94,37.23 20.81,37.23 | 20.81,37.23 20.35,37.23 JP3.15 | JP3.17 21.16,34.76 21.22,34.82 21.22,35.27 21.19,35.31 | 21.11,36.66 21.11,36.93 20.81,37.23 | JP3.16 11.71,37.3 11.65,37.21
  Bottom 1.27: v25.23,37.23 25.78,37.79 25.78,37.81 | 14.71,37.3 20.23,37.3 JP3.15
  Bottom 1.422: 11.65,37.21 11.66,35.43 12.27,34.88
  Bottom 1.778: 25.78,37.81 25.78,38.55 24.65,39.68 24.65,56.6 21.48,59.76 M1O3.P$1 | 21.19,35.31 21.19,36.58 21.11,36.66
M1QA  (via drill 0.3)
  Top 0.254: v12.27,15.71 12.75,15.23 12.75,15.17 IC1.42 | v7.99,22.06 v7.99,20.15
  Bottom 0.254: v12.27,15.71 11.95,15.39 7.51,15.39 6.87,16.02 6.87,19.83 7.19,20.15 v7.99,20.15 | JP3.28 v7.99,22.06
M1QB  (via drill 0.3)
  Top 0.254: IC1.41 13.53,15.72 12.75,16.5 v10.53,16.5
  Bottom 0.254: JP3.32 11,16.98 v10.53,16.5
MISO  (via drill 0.6)
  Top 0.254: IC1.16 14.33,4.31 16.2,6.18 v16.28,6.18
  Bottom 0.254: R3.1 25.16,14.91 25.16,17.64 25.61,18.09 26.72,18.09 27.19,17.61 27.19,10.15 26.08,9.04 23.7,9.04 22.73,8.06 17.57,8.06 17.27,7.77 17.27,6.89 16.56,6.18 v16.28,6.18
MOSI  (via drill 0.6)
  Top 0.254: IC1.15 13.53,4.09 14.58,5.14 14.58,6.29 15.64,7.35 v16.32,7.35
  Bottom 0.254: R2.1 26.72,15.97 26.72,10.47 25.77,9.51 23.54,9.51 22.51,8.48 17.19,8.48 16.32,7.61 v16.32,7.35
N$1
  Top 0.254: R1.1 2.57,18.51 LED9.A
N$2
  Top 0.254: U$1.29 18.47,28.73 19.26,29.52 20,29.52 C6.2
N$3  (via drill 0.3)
  Top 0.254: v23.23,21.58 v24.81,21.58
  Bottom 0.254: R3.2 24.07,15.71 23.38,15.71 23.07,16.02 23.07,17.93 22.75,18.25 22.75,19.52 23.07,19.83 24.34,19.83 24.81,20.31 v24.81,21.58 | JP3.27 22.43,22.06 v23.23,21.58
N$4
  Bottom 0.254: JP3.29 20.37,19.43 20.37,18.4 20.69,18.09 22.27,18.09 22.27,18.08 22.65,17.7 22.65,15.8 23.23,15.23 23.23,14.15 23.47,13.9 24.07,13.9 R4.2
N$6
  Top 0.305: 10.18,39.06 Q6.GATE
  Top 0.813: R6.2 9.91,39.06 10.18,39.06
N$7
  Top 0.254: Q1.GATE 10.88,49.31 R8.2
N$8
  Top 0.254: IC1.40 14.33,16.35 14.81,16.82 14.81,17.82 C33.2
N$9
  Top 0.254: U$1.30 17.91,29.23 C6.1
N$10
  Top 0.254: Q2.GATE 11.99,56.96 R10.2
N$11
  Top 0.305: 27.95,39.36 Q3.GATE
  Top 0.406: R12.2 28.34,39.87 Q3.GATE
N$12
  Top 0.254: U$1.28 19.92,28.23 C1.2
N$13
  Top 0.254: R13.2 28.2,47.36 Q4.GATE
N$14
  Top 0.254: Q5.GATE 28.36,55.33 29.58,55.33 29.58,57.17 R14.2
N$15
  Top 0.254: U$1.25 18.33,26.73 19.04,26.02 19.04,23.93 19.05,23.92 19.05,23.91 19.1,23.87 19.1,21.47 C4.2
N$16  (via drill 0.38)
  Top 0.254: R6.1 11.98,40.63 12.21,40.41 12.4,40.41 13.99,38.82 13.99,38.12 13.02,37.15 13.02,36.06 v12.98,36.03 | U$1.38 12.61,32.3 13.8,33.49 13.8,34.37 14.43,35.01 v14.43,36.03
  Bottom 0.254: v12.98,36.03 v14.43,36.03
N$17  (via drill 0.38, 0.6)
  Top 0.254: U$1.34 14.61,31.7 15.7,32.79 15.7,33.55 16.46,34.31 16.46,39.65 15.45,40.66 15.45,44.75 16.8,46.11 16.8,46.81 15.61,48 15.61,53.84 13.52,55.93 13.52,57.56 13.21,57.87 11.7,57.87 v11.65,57.82 | v26.84,58.23 26.95,58.23 26.95,57.63 28.01,57.63 R14.1
  Bottom 0.254: v26.84,58.23 26.38,58.7 24.53,58.7 22.16,61.06 14.89,61.06 v11.65,57.82
N$18  (via drill 0.38)
  Top 0.254: U$1.37 13.11,32.1 14.3,33.3 14.3,34.18 15.13,35.01 15.13,39.07 14.02,40.22 14.02,42.43 13.35,43.07 13.35,43.52 v13.1,43.77 | R13.1 30,50.11 29.8,50.31 27.38,50.31 26.43,49.36 26.43,45.74 26.24,45.55 18.24,45.55 17.2,44.51 v17.2,43.49
  Bottom 0.254: v13.1,43.77 16.92,43.77 v17.2,43.49
N$19  (via drill 0.3, 0.38)
  Top 0.254: U$1.40 11.61,33.64 v11.58,33.69
  Top 0.305: v19.1,35.87 23.7,35.87 24.08,36.25 27.73,36.25 29.26,37.93 32.38,37.93 R12.1
  Bottom 0.254: v19.1,35.87 18.15,35.87 17.83,35.55 17.83,34.12 17.35,33.64 11.6,33.64 v11.58,33.69
N$20
  Top 0.254: U$1.35 14.11,31.83 15.19,32.91 15.19,33.74 16.02,34.57 16.02,39.46 15,40.47 15,42.76 14.3,43.46 14.3,45.36 12.91,46.76 12.91,48.03 12.4,48.54 12.4,49.5 R8.1
N$21  (via drill 0.38)
  Top 0.254: U$1.32 15.61,31.43 16.72,32.53 16.72,33.11 17.35,33.8 17.35,40.03 16.46,40.92 16.46,43.86 16.75,44.15 16.75,44.7 17.88,45.83 17.88,46.95 16.5,48.32 16.5,49.31 16.59,49.4 16.59,55.14 17.35,55.9 v17.35,56.92 | v15.45,56.92 14.51,56.92 R10.1
  Bottom 0.254: v17.35,56.92 v15.45,56.92
N$22
  Top 0.254: 7.67,26.82 8.21,26.82 8.99,27.73 U$1.4 | 7.67,27.61 7.61,27.73 R17.1 7.67,28.72 8,29.05 9.48,29.05 9.81,28.72 9.95,28.72 U$1.2 | 10.43,26.73 U$1.6 9.7,26.73 9.5,26.52 9.5,26.06 9.17,25.74 7.9,25.74 R16.2
  Top 0.305: R17.1 7.67,27.61 7.67,26.82 R16.2
N$23  (via drill 0.3)
  Top 0.254: U$1.20 16.11,23.33 16.24,23.33 16.56,23.33 17.03,22.85 v17.03,19.83 | v24.02,20.47 22.7,20.47 R79.1
  Bottom 0.254: v17.03,19.83 18.46,20.47 v24.02,20.47
N$24
  Top 0.254: U$1.18 15.11,22.28 R7.2
N$28
  Top 0.254: U$1.17 14.61,22.72 13.87,21.98 R63.2
N$31
  Top 0.254: 14.11,23.1 U$1.16 14.11,22.9 13.87,22.67 12.3,22.67 | 12.3,22.67 R9.2 | 12.3,22.67
N$32  (via drill 0.3)
  Top 0.254: U$1.22 17.2,25.23 17.83,25.23 18.15,24.91 18.15,21.26 v17.83,20.94 | v24.18,26.66 22.7,26.66 R11.1
  Bottom 0.254: v17.83,20.94 23.54,20.94 24.02,21.26 24.02,22.83 24.18,22.99 24.18,24.08 24.27,24.18 24.27,24.85 24.5,25.07 24.5,26.34 v24.18,26.66
N$34
  Bottom 0.254: R15.2 23.38,11.1 22.75,11.74 22.75,12.42 22.27,12.9 22.27,13.46 22.75,13.93 22.75,14.95 22,15.71 20.68,15.71 | 20.69,15.71 20.68,15.71 | JP3.31 20.37,16.89 20.37,16.02 20.68,15.71
N$45  (via drill 0.3)
  Top 0.254: v24.83,23.05 23.59,24.29 v23.59,24.43
  Bottom 0.254: R2.2 24.07,17.77 23.86,17.77 23.23,18.4 23.23,19.2 23.38,19.36 24.5,19.36 25.45,20.31 25.45,21.1 25.61,21.26 25.61,21.74 24.83,22.52 v24.83,23.05 | v23.59,24.43 20.44,24.44 JP3.25
N$98  (via drill 0.3)
  Top 0.254: 22.86,23.8 R78.1 22.38,23.31 v23.53,23.31 | U$1.21 17.54,24.73 17.73,24.72 17.73,24.34 17.35,23.96 v17.03,23.96
  Bottom 0.254: v17.03,23.96 17.19,23.96 17.99,23.33 23.54,23.33 23.54,23.31 v23.53,23.31
N$114
  Top 0.254: LED11.A 4.35,13.57 R99.1
N$117
  Top 0.254: LED13.A 4.35,8.49 R101.1
N$119
  Top 0.254: R103.1 2.45,3.27 LED15.A
O1  (via drill 0.3, 0.6)
  Top 0.254: 28.36,44.02 Q3.SOURCE 26.88,42.58 v26.88,41.58 | v18,38.88 17.99,38.41 17.99,33.61 17.19,32.82 17.19,32.22 16.11,31.13 U$1.31
  Top 0.813: 28.15,52.3 28.15,51.82 Q4.SOURCE
  Top 2.54: Q5.SOURCE 30.7,59.92 32.24,58.37 32.24,51.89 | 32.24,51.89 v32.24,45.14 31.12,44.02 28.36,44.02 | 32.24,51.89 32.17,51.82 32.17,52.3 28.15,52.3
  Bottom 0.254: v18,38.88 23.26,38.88 24.21,37.93 24.21,35.96 24.72,35.45 27,35.45 27.51,35.96 27.51,39.77 26.75,40.53 26.75,41.46 v26.88,41.58
  Bottom 2.54: R18.2 32.24,43.06 v32.24,45.14
PWM1  (via drill 0.3)
  Top 0.152: 18.55,4.65 19.73,3.48 19.73,2.69 19.99,2.44 v19.99,1.49
  Top 0.254: U$1.19 15.61,23.95 15.61,22.93 15.6,22.93 15.91,22.63 16.46,22.63 16.56,22.53 16.56,21.14 10.68,21.14 9.41,19.99 9.41,18.88 9.73,18.56 9.73,14.59 10.68,13.32 12.27,13.32 13.22,12.37 13.22,10.8 15.46,8.56 16.91,8.56 18.25,7.21 18.25,6.52 18.55,6.22 18.55,4.65 | IC1.23 20.92,4.59 21.01,4.51 21.88,4.51 22.11,4.28 22.11,3.96 21.96,3.8 21.48,3.8 21.48,1.51 v21.49,1.5
  Bottom 0.152: v19.99,1.49 20.25,1.76 21.23,1.76 v21.49,1.5
RESET  (via drill 0.3, 0.38)
  Top 0.152: v20.49,3.32 20.21,3.48 18.94,4.75 18.94,6.34 18.62,6.66 18.62,12.69 18.3,13.01 18.3,13.86 | S2.2 30.92,5.95 30.37,6.5 30.37,11.58 JP1.6
  Top 0.254: v24.42,3.04 v24.39,0.86 | 18.3,13.86 IC1.35 | v32.59,3.83 32.59,5.87 S2.2
  Bottom 0.178: R113.1 27.72,2.58 27.67,2.53 24.89,2.53 24.41,3.01 24.41,3.1 24.34,3.16
  Bottom 0.254: v20.49,3.32 20.69,3.16 24.34,3.16 v24.42,3.04 | v24.39,0.86 29.92,0.81 30.85,1.74 30.85,2.09 v32.59,3.83
SCK  (via drill 0.6)
  Top 0.254: IC1.17 15.13,3.92 15.63,4.42 16.13,4.42 v17.34,5.66
  Bottom 0.254: R4.1 25.18,13.01 25.18,13.65 24.76,14.08 24.75,14.08 24.75,18.1 25.21,18.56 27.04,18.56 27.67,17.93 27.67,9.57 26.67,8.56 23.86,8.56 22.91,7.61 17.99,7.61 17.77,7.39 17.77,6.09 v17.34,5.66
SS_M  (via drill 0.6)
  Top 0.254: IC1.14 12.73,4.63 v13.77,5.66
  Bottom 0.152: v13.77,5.66 13.77,5.65 13.78,5.63
  Bottom 0.254: R15.1 24.76,9.99 23.54,9.99 23.38,10.15 16.88,10.15 16.88,8.88 16.42,8.43 15.98,8.43 15.5,7.96 15.5,6.19 15.35,6.03 14.18,6.03 13.78,5.63 13.74,5.59
TSENSE1  (via drill 0.3)
  Top 0.254: IC1.22 19.13,1.53 v19.1,1.42
  Bottom 0.254: v19.1,1.42 19.1,1.74 2.43,1.74 1.32,2.85 1.32,34.84 U$5.2

### Text on the board
tPlace: Priorities: / 1. don't catch on fire / 2. play soccer